# Altium project Adafruit SHT4x Trinkey.PrjPcb
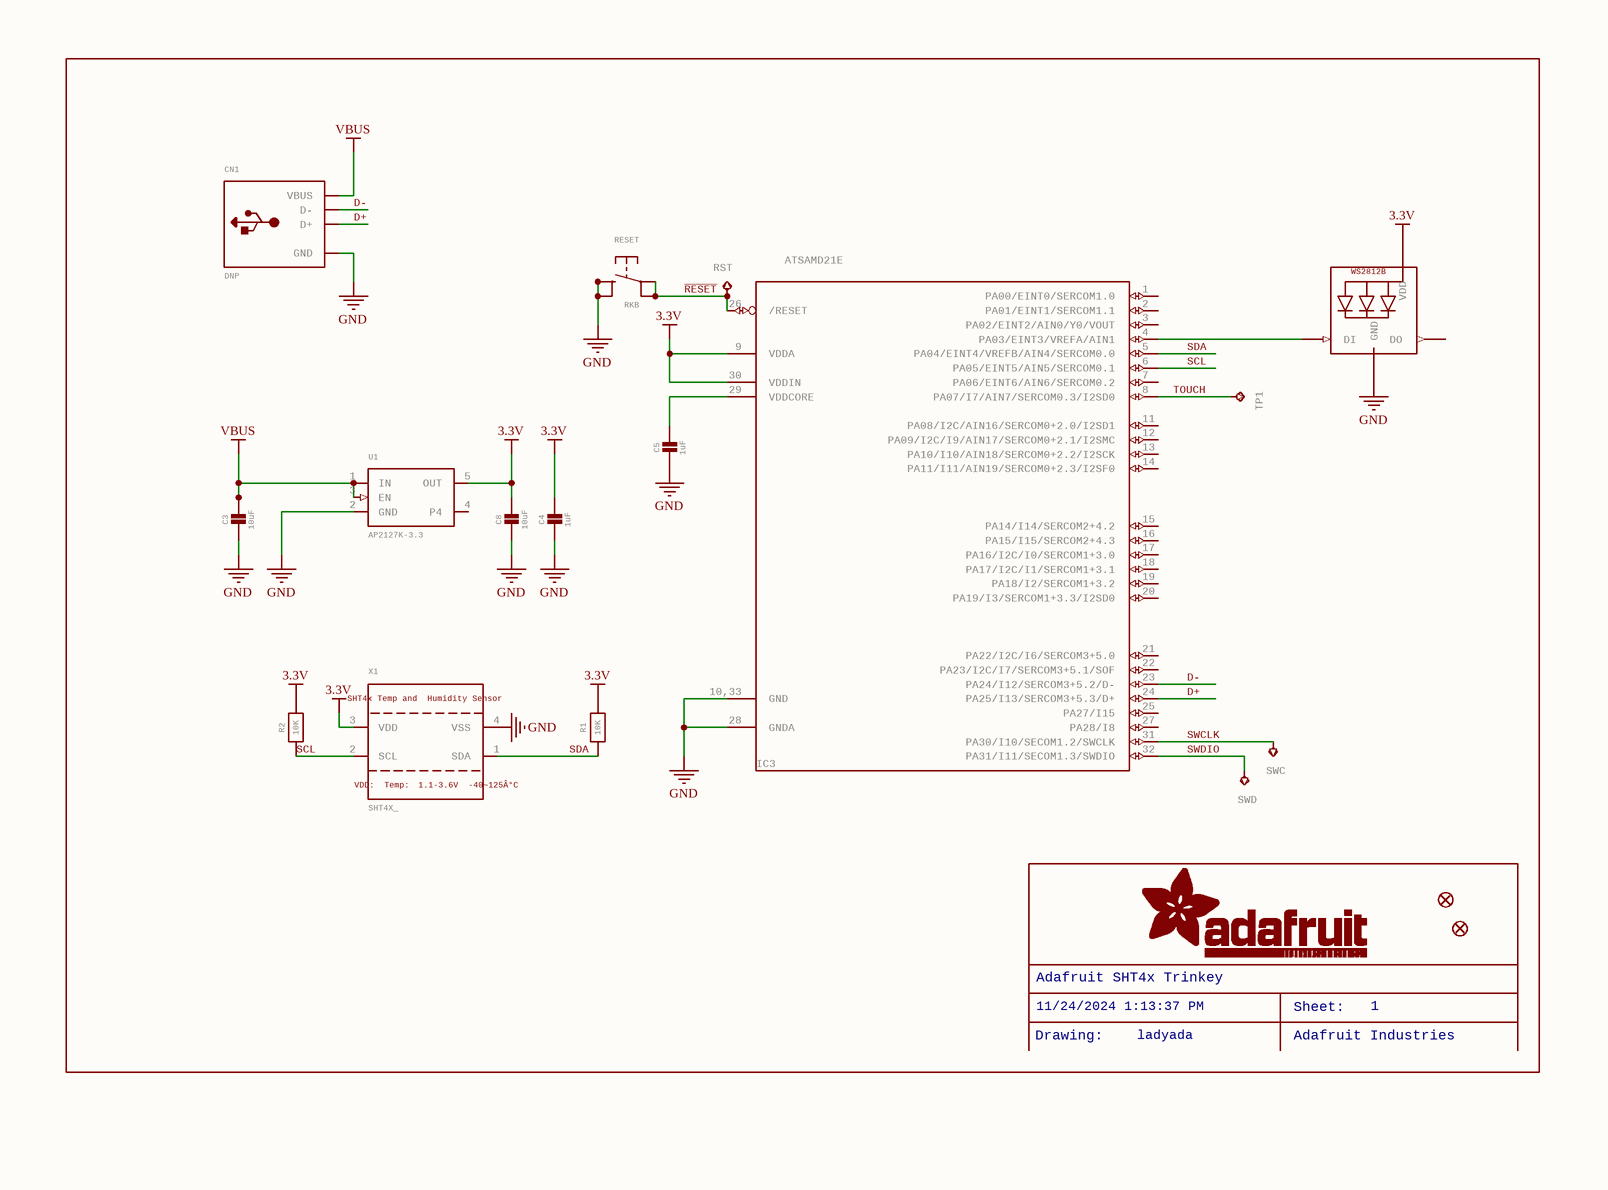
[diagram p0: Adafruit SHT4x Trinkey.SchDoc]
1 sheet, 18 parts. Net scope: global (net labels, ports and power ports of the same name join across sheets).
Board file: Adafruit SHT4x Trinkey.PcbDoc

## Sheet Adafruit SHT4x Trinkey.SchDoc: Adafruit SHT4x Trinkey
size 282 x 208 mm; Origin: Eagle; Date: 11/24/2024 1:13:37 PM; SheetNumber: 1; Author: AUTHOR; GateName_1: G$1; SymbolName_1: FRAME_A4_ADAFRUIT; LibraryName: microbuilder; DeviceSetName: FRAME_A4_ADAFRUIT; Sheet: Sheet:; AdafruitIndustries: Adafruit Industries; Drawing: Drawing:

### Parts
C3  10uF  [0805-NO]
C4  1uF  [_0603MP]
C5  1uF  [0603-NO]
C8  10uF  [0805-NO]
CN1  DNP  [USBA_PCB]
FID1  FIDUCIAL_0.5MM  [FIDUCIAL_0.5MM]  (value not drawn)
FID2  FIDUCIAL_0.5MM  [FIDUCIAL_0.5MM]  (value not drawn)
IC3  ATSAMD21E  [QFN32_5MM]
LED1  WS2812B_SK6805_1515  [SK6805_1515]  (value not drawn)
R1  10K  [_0402NO]
R2  10K  [_0402NO]
RESET  RKB  [BTN_RKB2_4.6X2.8]
RST  TPTP16R  [TP16R]  (value not drawn)
SWC  TPTP15R  [TP15R]  (value not drawn)
SWD  TPTP16R  [TP16R]  (value not drawn)
TP1  DNP  [TP13R]  (value not drawn)
U1  AP2127K-3.3  [SOT23-5]
X1  SHT4X_  SHT4xTempand
HumiditySensor: SHT4x Temp and / Humidity Sensor  VDD:
Temp: VDD: / Temp:  1.1-3.6V
-40~125Â°C: 1.1-3.6V / -40~125Â°C  [SHT4X]

### Nets
3.3V: C4.1 C8.1 IC3.9(VDDA) IC3.30(VDDIN) LED1.2(VDD) R1.2 R2.2 U1.5(OUT) X1.3(VDD)
GND: C3.2 C4.2 C5.2 C8.2 CN1.GND IC3.10,33(GND) IC3.28(GNDA) LED1.4(GND) RESET.B(S) RESET.B'(S1) U1.2(GND) X1.4(VSS)
VBUS: C3.1 CN1.VCC(VBUS) U1.1(IN) U1.3(EN)
D+: CN1.USB_PLUS(D+) IC3.24(PA25/I13/SERCOM3+5.3/D+)
D-: CN1.USB_NEG(D-) IC3.23(PA24/I12/SERCOM3+5.2/D-)
~{RESET}: IC3.26(/RESET) RESET.A(P) RESET.A'(P1) RST.TP
SCL: IC3.6(PA05/EINT5/AIN5/SERCOM0.1) R2.1 X1.2(SCL)
SDA: IC3.5(PA04/EINT4/VREFB/AIN4/SERCOM0.0) R1.1 X1.1(SDA)
SWCLK: IC3.31(PA30/I10/SECOM1.2/SWCLK) SWC.TP
SWDIO: IC3.32(PA31/I11/SECOM1.3/SWDIO) SWD.TP
TOUCH: IC3.8(PA07/I7/AIN7/SERCOM0.3/I2SD0) TP1.TP
NetC5_1: C5.1 IC3.29(VDDCORE)
NetIC3_4: IC3.4(PA03/EINT3/VREFA/AIN1) LED1.1(DI)

Not connected (* = marked no-connect by the designer): IC3 1(PA00/EINT0/SERCOM1.0) 2(PA01/EINT1/SERCOM1.1) 3(PA02/EINT2/AIN0/Y0/VOUT) 7(PA06/EINT6/AIN6/SERCOM0.2) 11(PA08/I2C/AIN16/SERCOM0+2.0/I2SD1) 12(PA09/I2C/I9/AIN17/SERCOM0+2.1/I2SMC) 13(PA10/I10/AIN18/SERCOM0+2.2/I2SCK) 14(PA11/I11/AIN19/SERCOM0+2.3/I2SF0) 15(PA14/I14/SERCOM2+4.2) 16(PA15/I15/SERCOM2+4.3) 17(PA16/I2C/I0/SERCOM1+3.0) 18(PA17/I2C/I1/SERCOM1+3.1) 19(PA18/I2/SERCOM1+3.2) 20(PA19/I3/SERCOM1+3.3/I2SD0) 21(PA22/I2C/I6/SERCOM3+5.0) 22(PA23/I2C/I7/SERCOM3+5.1/SOF) 25(PA27/I15) 27(PA28/I8); LED1 3(DO); U1 4(P4)

### Notes on the sheet
- Adafruit SHT4x Trinkey
- Drawing:
- 11/24/2024 1:13:37 PM
- ladyada
- Sheet:
- Adafruit Industries
- 1

### Library data of the parts
C3 C8 = CAP_CERAMIC0805-NOOUTLINE: Ceramic Capacitors   For new designs, use the packages preceded by an '_' character since they are more reliable:   The following footprints should be used on most boards: _0402 - Standard footprint for regular board layouts  _0603 - Standard footprint for regular board layouts  _0805 - Standard footprint for regular board layouts  _1206 - Standard footprint for regular board layouts       For extremely tight-pitch boards where space is at a premium, the following 'micro-pitch' footprints can be used (smaller pads, no silkscreen outline, etc.): _0402MP - Micro-pitch footprint for very dense/compact boards  _0603MP - Micro-pitch footprint for very dense/compact boards  _0805MP - Micro-pitch footprint for very dense/compact boards  _1206MP - Micro-pitch footprint for very dense/compact boards; GateName_1: G$1; SymbolName_1: CAPACITOR; DeviceName: 0805-NOOUTLINE; LibraryName: microbuilder; DeviceSetName: CAP_CERAMIC
C4 = CAP_CERAMIC_0603MP: Ceramic Capacitors   For new designs, use the packages preceded by an '_' character since they are more reliable:   The following footprints should be used on most boards: _0402 - Standard footprint for regular board layouts  _0603 - Standard footprint for regular board layouts  _0805 - Standard footprint for regular board layouts  _1206 - Standard footprint for regular board layouts       For extremely tight-pitch boards where space is at a premium, the following 'micro-pitch' footprints can be used (smaller pads, no silkscreen outline, etc.): _0402MP - Micro-pitch footprint for very dense/compact boards  _0603MP - Micro-pitch footprint for very dense/compact boards  _0805MP - Micro-pitch footprint for very dense/compact boards  _1206MP - Micro-pitch footprint for very dense/compact boards; GateName_1: G$1; SymbolName_1: CAPACITOR; DeviceName: _0603MP; LibraryName: microbuilder; DeviceSetName: CAP_CERAMIC
C5 = CAP_CERAMIC0603_NO: Ceramic Capacitors   For new designs, use the packages preceded by an '_' character since they are more reliable:   The following footprints should be used on most boards: _0402 - Standard footprint for regular board layouts  _0603 - Standard footprint for regular board layouts  _0805 - Standard footprint for regular board layouts  _1206 - Standard footprint for regular board layouts       For extremely tight-pitch boards where space is at a premium, the following 'micro-pitch' footprints can be used (smaller pads, no silkscreen outline, etc.): _0402MP - Micro-pitch footprint for very dense/compact boards  _0603MP - Micro-pitch footprint for very dense/compact boards  _0805MP - Micro-pitch footprint for very dense/compact boards  _1206MP - Micro-pitch footprint for very dense/compact boards; GateName_1: G$1; SymbolName_1: CAPACITOR; DeviceName: 0603_NO; LibraryName: microbuilder; DeviceSetName: CAP_CERAMIC
CN1 = USB_TYPEAPCB: USB - Type A Connectors   Male types stick out and are inserted into a PC or matching females parts (these are the connectors used on USB Memory Sticks, etc.).  Female parts are generally used for USB Host and accept a male-type connector. SMT - 4UCON: 10017  PTHFML - Digikey: 609-1045-ND, 4UCon: 05241  PCB - Use 2.0mm thick PCBs with this footprint; GateName_1: G$1; SymbolName_1: USB_NOID; DeviceName: PCB; LibraryName: adafruit_electromech; DeviceSetName: USB_TYPEA
FID1 FID2 = FIDUCIAL_0.5MM: Fiducial Alignment Points   Various fiducial points for machine vision alignment.; GateName_1: G$1; DeviceName: _0.5MM; SymbolName_1: FIDUCIAL; LibraryName: microbuilder; DeviceSetName: FIDUCIAL
IC3 = ATSAMD21E: GateName_1: G$1; SymbolName_1: ATSAMD21E; LibraryName: adafruit_micro; DeviceSetName: ATSAMD21E
LED1 = WS2812B_SK6805_1515: GateName_1: G$1; SymbolName_1: WS2812BLED; DeviceName: _SK6805_1515; LibraryName: microbuilder; DeviceSetName: WS2812B; WS2812B: WS2812B; LCSC: C2890035
R1 R2 = RESISTOR_0402NO: Resistors   For new designs, use the packages preceded by an '_' character since they are more reliable:   The following footprints should be used on most boards: _0402 - Standard footprint for regular board layouts  _0603 - Standard footprint for regular board layouts  _0805 - Standard footprint for regular board layouts  _1206 - Standard footprint for regular board layouts       For extremely tight-pitch boards where space is at a premium, the following 'micro-pitch' footprints can be used (smaller pads, no silkscreen outline, etc.): _0402MP - Micro-pitch footprint for very dense/compact boards  _0603MP - Micro-pitch footprint for very dense/compact boards  _0805MP - Micro-pitch footprint for very dense/compact boards  _1206MP - Micro-pitch footprint for very dense/compact boards; GateName_1: G$1; SymbolName_1: RESISTOR; DeviceName: _0402NO; LibraryName: microbuilder; DeviceSetName: RESISTOR
RESET = SWITCH_TACT_SMT_RKB2: SMT Tact Switches RKB2 https://www.digikey.com/short/m027prz5; GateName_1: G$1; SymbolName_1: BUTTON_4PIN; DeviceName: _RKB2; LibraryName: adafruit_electromech; DeviceSetName: SWITCH_TACT_SMT
RST SWD = TPTP16R: Test pad; GateName_1: G$1; SymbolName_1: TP; POPULARITY: 0; DeviceName: TP16R; LibraryName: testpad; DeviceSetName: TP
SWC = TPTP15R: Test pad; GateName_1: G$1; SymbolName_1: TP; POPULARITY: 0; DeviceName: TP15R; LibraryName: testpad; DeviceSetName: TP
TP1 = TPTP13R: Test pad; GateName_1: G$1; SymbolName_1: TP; POPULARITY: 0; DeviceName: TP13R; LibraryName: testpad; DeviceSetName: TP
U1 = VREG_SOT23-5: SOT23-5 Fixed Voltage Regulators      Part	Current Out	V Out	V In	V Dropout	Î¸JA (Â°C/W)	TJ (Â°C)	Digikey Part No.	     ADP121	  150mA	  3.3V	  3.4-5.5V	  0.09V @ 150mA	  --	  --	  ADP121-AUJZ33R7CT-ND	     ADP121	  150mA	  3.0V	  3.1-5.5V	  0.09V @ 150mA	  --	  --	  ADP121-AUJZ30R7CT-ND	     ADP122	  300mA	  3.3V	  3.4-5.5V	  0.085V @ 300mA	  --	  --	  ADP122AUJZ-3.3-R7CT-ND	     ADP1712	  300mA	  3.3V	  3.5-5.5V	  0.17V @ 300mA	  --	  --	  ADP1712AUJZ-3.3-R7TR-ND	     AP7311 (Low Cost)	  150mA	  3.3V	  3.5-6V	  0.15V @ 150mA	  --	  --	  AP7311-33WG-7DICT-ND	     LD39015M18R	  150mA	  1.8V	  1.9V-5.5V	  0.08V @ 100mA	  --	  --	  497-6977-1-ND	     LP2985A-33DBVR	  150mA	  3.3V	  3.3-16V	  0.28V @ 150mA	  206	  150	  296-18479-1-ND	     MCP1824T-3302E/OT	  300mA	  3.3V	  3.5V-6V	  0.2V @ 300mA	  --	  --	  MCP1824T-3302E/OTCT-ND	     MIC5205-2.5YM5 TR	  150mA	  2.5V	  2.7-16V	  0.165V @ 150mA	  --	  --	  576-1257-2-ND	     MIC5205-3.0YM5 TR	  150mA	  3.0V	  3.2V-16V	  0.165V @ 150mA	  --	  --	  576-1258-2-ND	     MIC5205-3.3YM5 TR	  150mA	  3.3V	  3.5V-16V	  0.165V @ 150mA	  --	  --	  576-1259-2-ND	     TPS780330220	  150mA	  3.3V+2.2V	  3.6-5.5V	  250mV Max	  --	  --	  296-23332-1-ND	     TDA3663/N1,135	  100mA	  3.3V	  3.5-45V	  0.18V @ 50mA	  --	  --	  568-5343-1-ND	     	  	  	  	  	  	  	  	     	  	  	  	  	  	  	  	   Max operating temp can be calculated using Î¸JA, TJ (max junction temperature), and power in watts.  Set the "Maximum Ambient Temperature" until it reaches TJ ("Max Junction Temperature"), which is the absolute limit for safe use of the regulator: Heat Sink Temperature Calculator   For example, With 12V source into a 3.3V LP2985 and a 30mA load, we are dissipating (12V-3.3V) * 0.03A = 0.261W.  With a Î¸JA of 206 Â°C/W, a TJ of 150Â°C, and 261mW we can safely use the chip without a heat sink up to 75Â°C (=147.1Â°C Junction Temperature).; GateName_1: G$1; SymbolName_1: VREG_SOT23-5; LibraryName: adafruit_power; DeviceSetName: VREG_SOT23-5; JLC_ROTATION: 0
X1 = SHT4X_: GateName_1: G$1; DeviceName: _; SymbolName_1: SHT4X; LibraryName: adafruit_sensor; DeviceSetName: SHT4X